# Altium schematic sheet flyback.SchDoc
size 297 x 209 mm
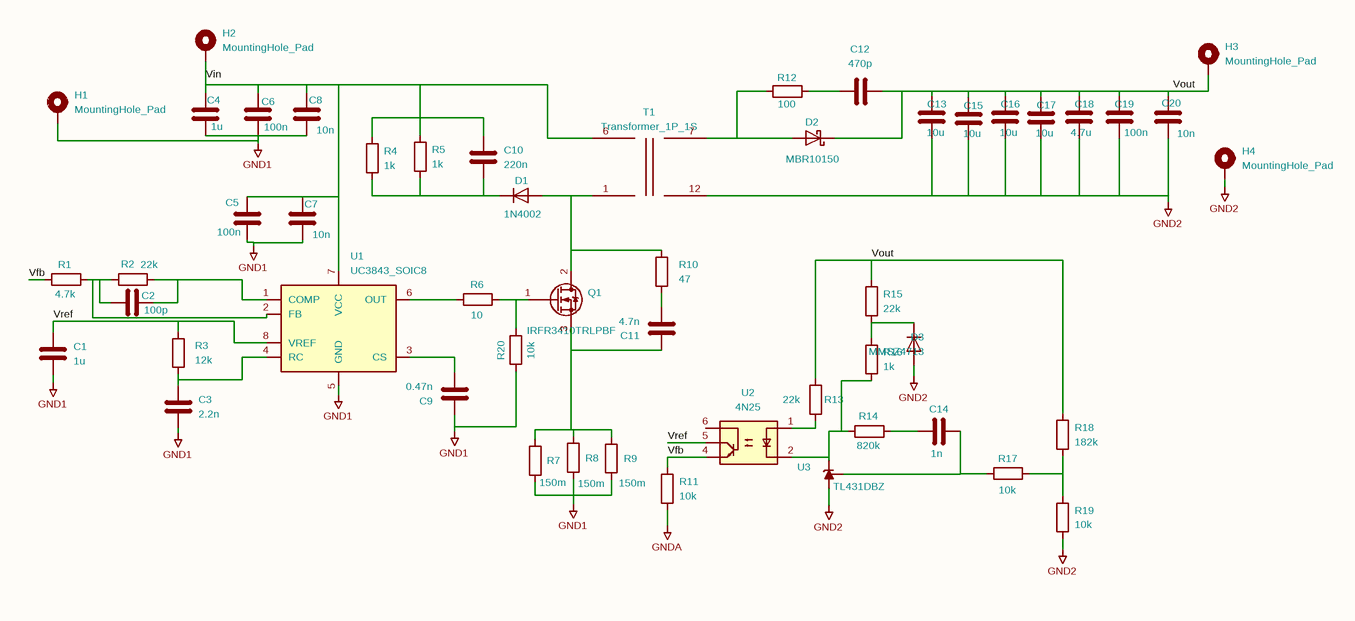
[diagram p0: flyback.SchDoc]

## Parts
C1  1u  [C_0805_2012Metric]
C2  100p  [C_0805_2012Metric]
C3  2.2n  [C_0805_2012Metric]
C4  1u  [C_0805_2012Metric]
C5  100n  [C_0805_2012Metric]
C6  100n  [C_0805_2012Metric]
C7  10n  [C_1206_3216Metric]
C8  10n  [C_1206_3216Metric]
C9  0.47n  [C_0805_2012Metric]
C10  220n  [C_0805_2012Metric]
C11  4.7n  [C_0805_2012Metric]
C12  470p  [C_1206_3216Metric]
C13  10u  [C_2220_5650Metric]
C14  1n  [C_0805_2012Metric]
C15  10u  [C_2220_5650Metric]
C16  10u  [C_2220_5650Metric]
C17  10u  [C_2220_5650Metric]
C18  4.7u  [C_2220_5650Metric]
C19  100n  [C_0805_2012Metric]
C20  10n  [C_1206_3216Metric]
D1  1N4002  [D_DO-41_SOD81_P10.16mm_Horizontal]
D2  MBR10150  [TO-220-2_Vertical]
D3  MMSZ4713  [D_SOD-123]
H1  MountingHole_Pad  [MountingHole_2.2mm_M2]
H2  MountingHole_Pad  [MountingHole_2.2mm_M2]
H3  MountingHole_Pad  [MountingHole_2.2mm_M2]
H4  MountingHole_Pad  [MountingHole_2.2mm_M2]
Q1  IRFR3410TRLPBF  [TO-252-2]
R1  4.7k  [R_0805_2012Metric]
R2  22k  [R_0805_2012Metric]
R3  12k  [R_0805_2012Metric]
R4  1k  [R_0805_2012Metric]
R5  1k  [R_0805_2012Metric]
R6  10  [R_0805_2012Metric]
R7  150m  [R_2512_6332Metric]
R8  150m  [R_2512_6332Metric]
R9  150m  [R_2512_6332Metric]
R10  47  [R_0805_2012Metric]
R11  10k  [R_0805_2012Metric]
R12  100  [R_0805_2012Metric]
R13  22k  [R_0805_2012Metric]
R14  820k  [R_0805_2012Metric]
R15  22k  [R_0805_2012Metric]
R16  1k  [R_0805_2012Metric]
R17  10k  [R_0805_2012Metric]
R18  182k  [R_0805_2012Metric]
R19  10k  [R_0805_2012Metric]
R20  10k  [R_0805_2012Metric]
T1  Transformer_1P_1S  [Transformer_37x44]
U1  UC3843_SOIC8  [SOIC-8_3.9x4.9mm_P1.27mm]
U2  4N25  [DIP-6_W7.62mm]
U3  TL431DBZ  [SOT-23]

## Nets
GND1: C1.2 C3.2 C4.1 C5.1 C6.1 C7.1 C8.1 C9.1 H1.1 R7.2 R8.2 R9.2 R20.1 U1.5(GND)
GND2: C13.1 C15.1 C16.1 C17.1 C18.1 C19.1 C20.1 D3.2(A) H4.1 R19.2 T1.12(SA) U3.3(A)
GNDA: R11.2
Vfb: R1.1 R11.1 U2.4
Vin: C4.2 C5.2 C6.2 C7.2 C8.2 C10.1 H2.1 R4.1 R5.1 T1.6(AA) U1.7(VCC)
Vout: C12.2 C13.2 C15.2 C16.2 C17.2 C18.2 C19.2 C20.2 D2.1(K) H3.1 R13.1 R15.1 R18.1
Vref: C1.1 R3.1 U1.8(VREF) U2.5
NetC2_1: C2.1 R1.2 R2.1 U1.2(FB)
NetC2_2: C2.2 R2.2 U1.1(COMP)
NetC3_1: C3.1 R3.2 U1.4(RC)
NetC9_2: C9.2 U1.3(CS)
NetC10_2: C10.2 D1.1(K) R4.2 R5.2
NetC11_1: C11.1 Q1.3(S) R7.1 R8.1 R9.1
NetC11_2: C11.2 R10.2
NetC12_1: C12.1 R12.2
NetC14_1: C14.1 R14.2
NetC14_2: C14.2 R17.1 U3.2(REF)
NetD1_2: D1.2(A) Q1.2(D) R10.1 T1.1(AB)
NetD2_2: D2.2(A) R12.1 T1.7(SB)
NetD3_1: D3.1(K) R15.2 R16.1
NetQ1_1: Q1.1(G) R6.2 R20.2
NetR6_1: R6.1 U1.6(OUT)
NetR13_2: R13.2 U2.1
NetR14_1: R14.1 R16.2 U2.2 U3.1(K)
NetR17_2: R17.2 R18.2 R19.1

Not connected (* = marked no-connect by the designer): U2 3(NC) 6

## Notes on the sheet
- 1
- 2
- 3
- 4
- 5
- 6
- A
- B
- C
- D
- Title:
- File: flyback.kicad_sch
- Sheet: /
- KiCad E.D.A.  kicad (5.1.4)-1
- Size: A4
- Date:
- Rev:
- Id: 1/1

## Library data of the parts
C1-C20 = C
  C1 C4: Value: 1u; Footprint: Capacitor_SMD:C_0805_2012Metric
  C2: Value: 100p; Footprint: Capacitor_SMD:C_0805_2012Metric
  C3: Value: 2.2n; Footprint: Capacitor_SMD:C_0805_2012Metric
  C5 C6 C19: Value: 100n; Footprint: Capacitor_SMD:C_0805_2012Metric
  C7 C8 C20: Value: 10n; Footprint: Capacitor_SMD:C_1206_3216Metric
  C9: Value: 0.47n; Footprint: Capacitor_SMD:C_0805_2012Metric
  C10: Value: 220n; Footprint: Capacitor_SMD:C_0805_2012Metric
  C11: Value: 4.7n; Footprint: Capacitor_SMD:C_0805_2012Metric
  C12: Value: 470p; Footprint: Capacitor_SMD:C_1206_3216Metric
  C13 C15-C17: Value: 10u; Footprint: Capacitor_SMD:C_2220_5650Metric
  C14: Value: 1n; Footprint: Capacitor_SMD:C_0805_2012Metric
  C18: Value: 4.7u; Footprint: Capacitor_SMD:C_2220_5650Metric
D2 = MBR735: Value: MBR10150; Footprint: Package_TO_SOT_THT:TO-220-2_Vertical
D3 = MMSD4148: Value: MMSZ4713; Footprint: Diode_SMD:D_SOD-123
Q1 = QM6006D: Value: IRFR3410TRLPBF; Footprint: Package_TO_SOT_SMD:TO-252-2
R1-R20 = R
  R1: Value: 4.7k; Footprint: Resistor_SMD:R_0805_2012Metric
  R2 R13 R15: Value: 22k; Footprint: Resistor_SMD:R_0805_2012Metric
  R3: Value: 12k; Footprint: Resistor_SMD:R_0805_2012Metric
  R4 R5 R16: Value: 1k; Footprint: Resistor_SMD:R_0805_2012Metric
  R6: Value: 10; Footprint: Resistor_SMD:R_0805_2012Metric
  R7-R9: Value: 150m; Footprint: Resistor_SMD:R_2512_6332Metric
  R10: Value: 47; Footprint: Resistor_SMD:R_0805_2012Metric
  R11 R17 R19 R20: Value: 10k; Footprint: Resistor_SMD:R_0805_2012Metric
  R12: Value: 100; Footprint: Resistor_SMD:R_0805_2012Metric
  R14: Value: 820k; Footprint: Resistor_SMD:R_0805_2012Metric
  R18: Value: 182k; Footprint: Resistor_SMD:R_0805_2012Metric
D1 = 1N4002: Value: 1N4002; Footprint: Diode_THT:D_DO-41_SOD81_P10.16mm_Horizontal
H1-H4 = MountingHole_Pad: Value: MountingHole_Pad; Footprint: MountingHole:MountingHole_2.2mm_M2
T1 = Transformer_1P_1S: Value: Transformer_1P_1S; Footprint: Transformer_THT:Transformer_37x44
U1 = UC3843_SOIC8: Value: UC3843_SOIC8; Footprint: Package_SO:SOIC-8_3.9x4.9mm_P1.27mm
U2 = 4N25: Value: 4N25; Footprint: Package_DIP:DIP-6_W7.62mm
U3 = TL431DBZ: Value: TL431DBZ; Footprint: Package_TO_SOT_SMD:SOT-23